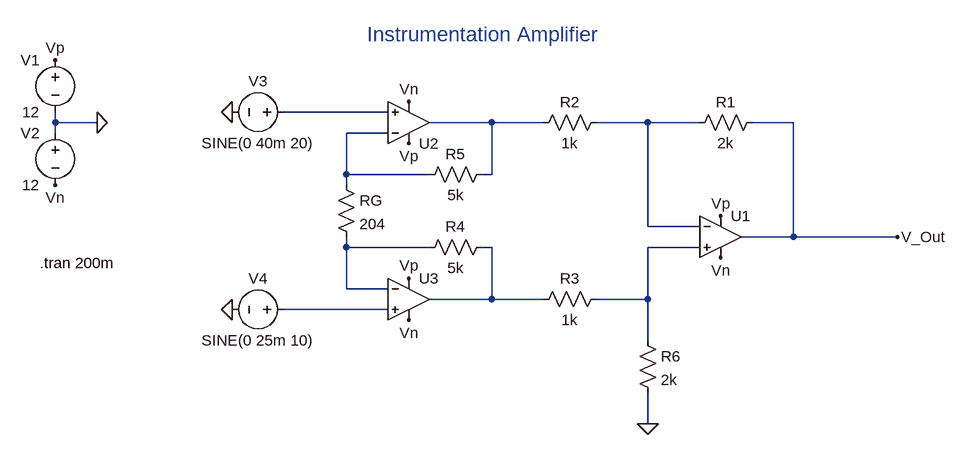
[diagram p0: schematic Instrumentation_Amplifier.asc]
Instrumentation_Amplifier.asc, the LTspice schematic file:
Version 4.1
SHEET 1 880 680
WIRE -80 -64 -240 -64
WIRE -592 -48 -592 -64
WIRE -528 -48 -592 -48
WIRE 80 -48 -16 -48
WIRE 160 -48 80 -48
WIRE 320 -48 240 -48
WIRE 400 -48 320 -48
WIRE 544 -48 480 -48
WIRE -592 -32 -592 -48
WIRE -80 -32 -144 -32
WIRE -144 32 -144 -32
WIRE -16 32 -144 32
WIRE 80 32 80 -48
WIRE 80 32 64 32
WIRE -144 48 -144 32
WIRE 320 112 320 -48
WIRE 400 112 320 112
WIRE 544 128 544 -48
WIRE 544 128 464 128
WIRE 704 128 544 128
WIRE -144 144 -144 128
WIRE -16 144 -144 144
WIRE 80 144 64 144
WIRE 400 144 320 144
WIRE -144 208 -144 144
WIRE -80 208 -144 208
WIRE 80 224 80 144
WIRE 80 224 -16 224
WIRE 160 224 80 224
WIRE 320 224 320 144
WIRE 320 224 240 224
WIRE -80 240 -240 240
WIRE 320 288 320 224
WIRE 320 416 320 368
FLAG -592 -144 Vp
FLAG 432 96 Vp
FLAG -592 48 Vn
FLAG -528 -48 0
FLAG 432 160 Vn
FLAG 320 416 0
FLAG -48 -16 Vp
FLAG -48 -80 Vn
FLAG -48 192 Vp
FLAG -48 256 Vn
FLAG -320 -64 0
FLAG -320 240 0
FLAG 704 128 V_Out
SYMBOL OpAmps\\UniversalOpAmp2 432 128 R0
SYMATTR InstName U1
SYMBOL voltage -592 -160 M0
WINDOW 123 0 0 Left 0
WINDOW 39 0 0 Left 0
SYMATTR InstName V1
SYMATTR Value 12
SYMBOL voltage -592 -48 M0
WINDOW 123 0 0 Left 0
WINDOW 39 0 0 Left 0
SYMATTR InstName V2
SYMATTR Value 12
SYMBOL OpAmps\\UniversalOpAmp2 -48 -48 M180
SYMATTR InstName U2
SYMBOL OpAmps\\UniversalOpAmp2 -48 224 R0
SYMATTR InstName U3
SYMBOL res -160 32 R0
SYMATTR InstName RG
SYMATTR Value 204
SYMBOL res 496 -64 R90
WINDOW 0 0 56 VBottom 2
WINDOW 3 32 56 VTop 2
SYMATTR InstName R1
SYMATTR Value 2k
SYMBOL res 256 -64 R90
WINDOW 0 0 56 VBottom 2
WINDOW 3 32 56 VTop 2
SYMATTR InstName R2
SYMATTR Value 1k
SYMBOL res 256 208 R90
WINDOW 0 0 56 VBottom 2
WINDOW 3 32 56 VTop 2
SYMATTR InstName R3
SYMATTR Value 1k
SYMBOL res -32 160 R270
WINDOW 0 32 56 VTop 2
WINDOW 3 0 56 VBottom 2
SYMATTR InstName R4
SYMATTR Value 5k
SYMBOL res -32 48 R270
WINDOW 0 32 56 VTop 2
WINDOW 3 0 56 VBottom 2
SYMATTR InstName R5
SYMATTR Value 5k
SYMBOL voltage -224 -64 R90
WINDOW 0 -32 56 VBottom 2
WINDOW 3 32 56 VTop 2
WINDOW 123 0 0 Left 0
WINDOW 39 0 0 Left 0
SYMATTR InstName V3
SYMATTR Value SINE(0 40m 20)
SYMBOL voltage -224 240 R90
WINDOW 0 -32 56 VBottom 2
WINDOW 3 32 56 VTop 2
WINDOW 123 0 0 Left 0
WINDOW 39 0 0 Left 0
SYMATTR InstName V4
SYMATTR Value SINE(0 25m 10)
SYMBOL res 304 272 R0
SYMATTR InstName R6
SYMATTR Value 2k
TEXT -112 -184 Left 3 ;Instrumentation Amplifier
TEXT -616 168 Left 2 !.tran 200m

The netlist it stands for:
* Instrumentation_Amplifier.asc
X§U1 N007 N003 Vp Vn V_Out level2 Avol=1Meg GBW=10Meg Slew=10Meg Ilimit=25m Rail=0 Vos=0 En=0 Enk=0 In=0 Ink=0 Rin=500Meg  ; pins In+ In- V+ V- OUT
V1 Vp 0 12
V2 0 Vn 12
X§U2 N001 N004 Vp Vn N002 level2 Avol=1Meg GBW=10Meg Slew=10Meg Ilimit=25m Rail=0 Vos=0 En=0 Enk=0 In=0 Ink=0 Rin=500Meg  ; pins In+ In- V+ V- OUT
X§U3 N008 N005 Vp Vn N006 level2 Avol=1Meg GBW=10Meg Slew=10Meg Ilimit=25m Rail=0 Vos=0 En=0 Enk=0 In=0 Ink=0 Rin=500Meg  ; pins In+ In- V+ V- OUT
RG N004 N005 204
R1 V_Out N003 2k
R2 N003 N002 1k
R3 N007 N006 1k
R4 N005 N006 5k
R5 N004 N002 5k
V3 N001 0 SINE(0 40m 20)
V4 N008 0 SINE(0 25m 10)
R6 N007 0 2k
* Instrumentation Amplifier
.tran 200m
.lib UniversalOpAmp2.lib
.backanno
.end